# Altium schematic sheet TVS_Diodes.SchDoc
size A; SheetNumber: 11; SheetTotal: 15
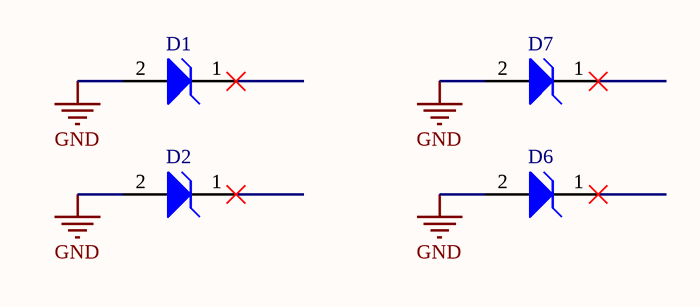
[diagram p0: TVS_Diodes.SchDoc]

## Parts
D1  MM3Z3V6T1G  [ONSC-SOD-323-2-477-02_V]  (value not drawn)
D2  MM3Z3V6T1G  [ONSC-SOD-323-2-477-02_V]  (value not drawn)
D6  MM3Z3V6T1G  [ONSC-SOD-323-2-477-02_V]  (value not drawn)
D7  MM3Z3V6T1G  [ONSC-SOD-323-2-477-02_V]  (value not drawn)

## Nets
GND: D1.2(A) D2.2(A) D6.2(A) D7.2(A)

Not connected (* = marked no-connect by the designer): D1 1(K)*; D2 1(K)*; D6 1(K)*; D7 1(K)*

## Library data of the parts
D1 D2 D6 D7 = CMP-1060-00650-1: Zener Voltage Regulator, 300 mW, 2-Pin SOD-323, Pb-Free, Tape and Reel; Manufacturer: On Semiconductor; VZ Typ (V): 3.6; P Max (W): 0.3; RoHS: Pb-Free; ComponentLink1URL: http://www.onsemi.com/; PackageVersion: Rev. H, 03/2007; PartNumber: MM3Z3V6T1G; ComponentLink2Description: Datasheet; ComponentLink2URL: http://www.onsemi.cn/pub_link/Collateral/MM3Z2V4T1-D.PDF; DatasheetVersion: Rev. 9; PackageReference: SOD-323-2-477-02; ComponentLink3URL: http://www.onsemi.com/pub_link/Collateral/477-02.PDF.1; Packing: Tape and Reel; Mounting Technology: Surface Mount; ComponentLink3Description: Package Specification; PackageDescription: 2-Pin SOD, Body 1.7 x 1.25 mm; ComponentLink1Description: Manufacturer URL